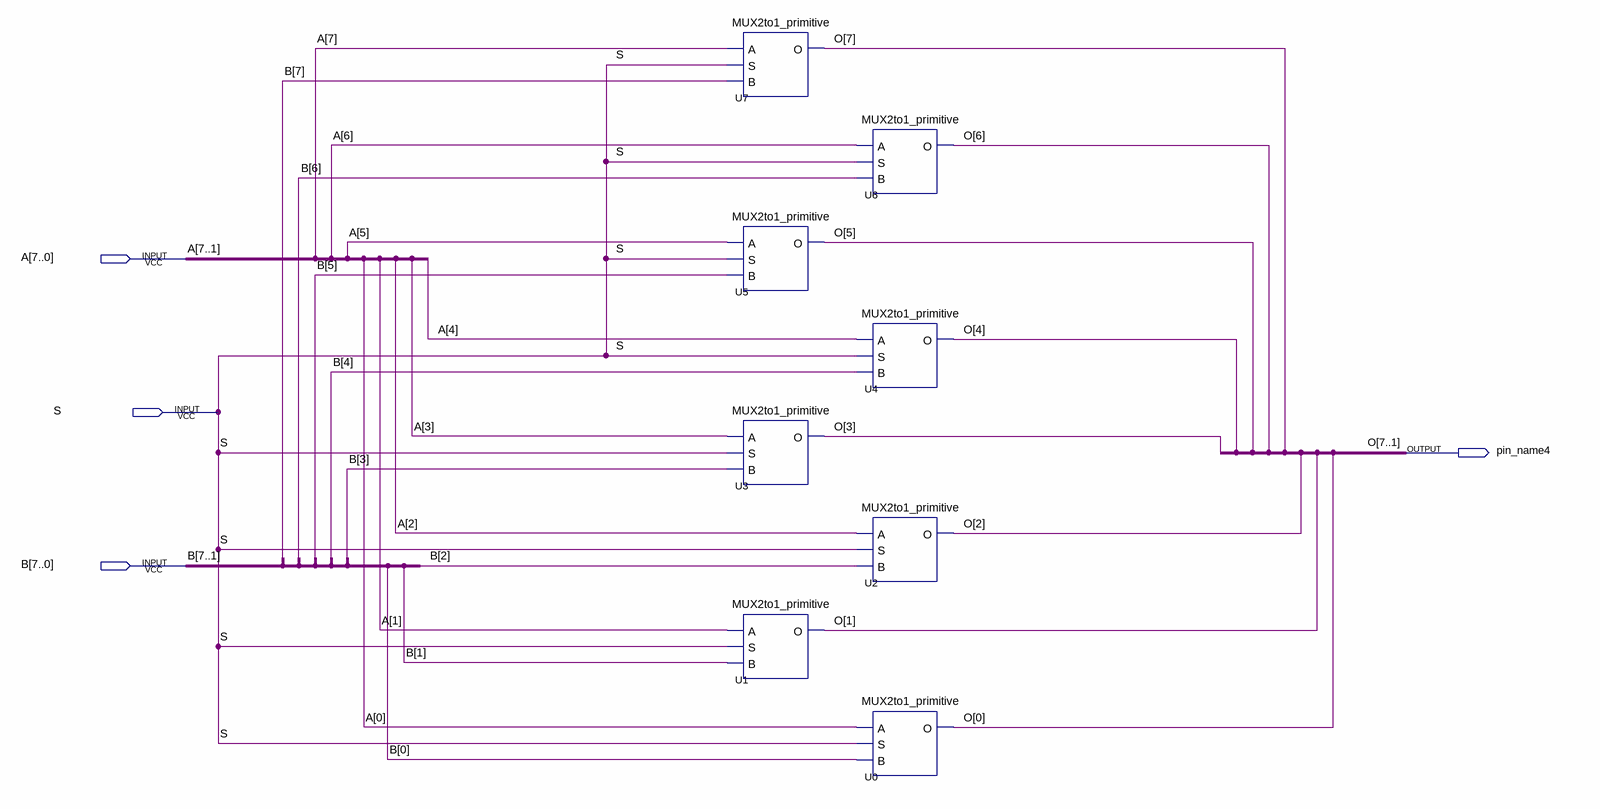
[diagram p0: schematic sheet]
// Quartus schematic MUX2to1_8bit.bdf as structural Verilog: 8 symbols, 4 pins
module MUX2to1_8bit (
  input  [7:0] A,
  input  S,
  input  [7:0] B,
  output pin_name4
);

  wire [7:0] O;

  MUX2to1_primitive U7 (.A(A[7]), .S(S), .B(B[7]), .O(O[7]));
  MUX2to1_primitive U5 (.A(A[5]), .S(S), .B(B[5]), .O(O[5]));
  MUX2to1_primitive U3 (.A(A[3]), .S(S), .B(B[3]), .O(O[3]));
  MUX2to1_primitive U1 (.A(A[1]), .S(S), .B(B[1]), .O(O[1]));
  MUX2to1_primitive U6 (.A(A[6]), .S(S), .B(B[6]), .O(O[6]));
  MUX2to1_primitive U4 (.A(A[4]), .S(S), .B(B[4]), .O(O[4]));
  MUX2to1_primitive U2 (.A(A[2]), .S(S), .B(B[2]), .O(O[2]));
  MUX2to1_primitive U0 (.A(A[0]), .S(S), .B(B[0]), .O(O[0]));
endmodule
